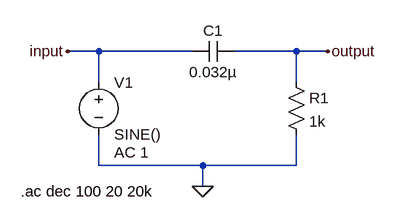
[diagram p0: schematic high-pass-filter.asc]
high-pass-filter.asc, the LTspice schematic file:
Version 4
SHEET 1 880 680
WIRE 16 80 -32 80
WIRE 160 80 16 80
WIRE 320 80 224 80
WIRE 368 80 320 80
WIRE 16 128 16 80
WIRE 320 128 320 80
WIRE 16 256 16 208
WIRE 176 256 16 256
WIRE 320 256 320 208
WIRE 320 256 176 256
WIRE 176 288 176 256
FLAG 176 288 0
FLAG -32 80 input
FLAG 368 80 output
SYMBOL voltage 16 112 R0
WINDOW 123 24 124 Left 2
WINDOW 39 0 0 Left 0
SYMATTR Value2 AC 1
SYMATTR InstName V1
SYMATTR Value SINE()
SYMBOL cap 224 64 R90
WINDOW 0 0 32 VBottom 2
WINDOW 3 32 32 VTop 2
SYMATTR InstName C1
SYMATTR Value 0.032µ
SYMBOL res 304 112 R0
SYMATTR InstName R1
SYMATTR Value 1k
TEXT -104 296 Left 2 !.ac dec 100 20 20k

The netlist it stands for:
* high-pass-filter.asc
V1 input 0 SINE() AC 1
C1 output input 0.032µ
R1 output 0 1k
.ac dec 100 20 20k
.backanno
.end

* Results of the author's LTspice run, read from the files saved beside the schematic
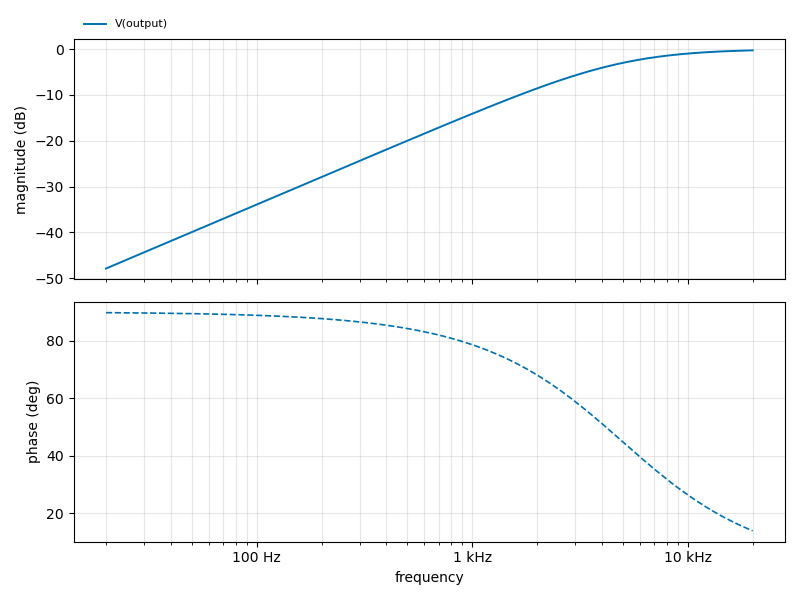
[diagram p1: AC Analysis of high-pass-filter.asc, plotted from the saved traces]
* AC Analysis, 1 run:
*   V(output): -47.91 dB at 20 Hz, -0.26 dB at 20 kHz, peak -0.26 dB at 20 kHz, 3 dB below the peak at 4.692 kHz